# EAGLE design wifi_reprap2 (EAGLE 7.4.0)
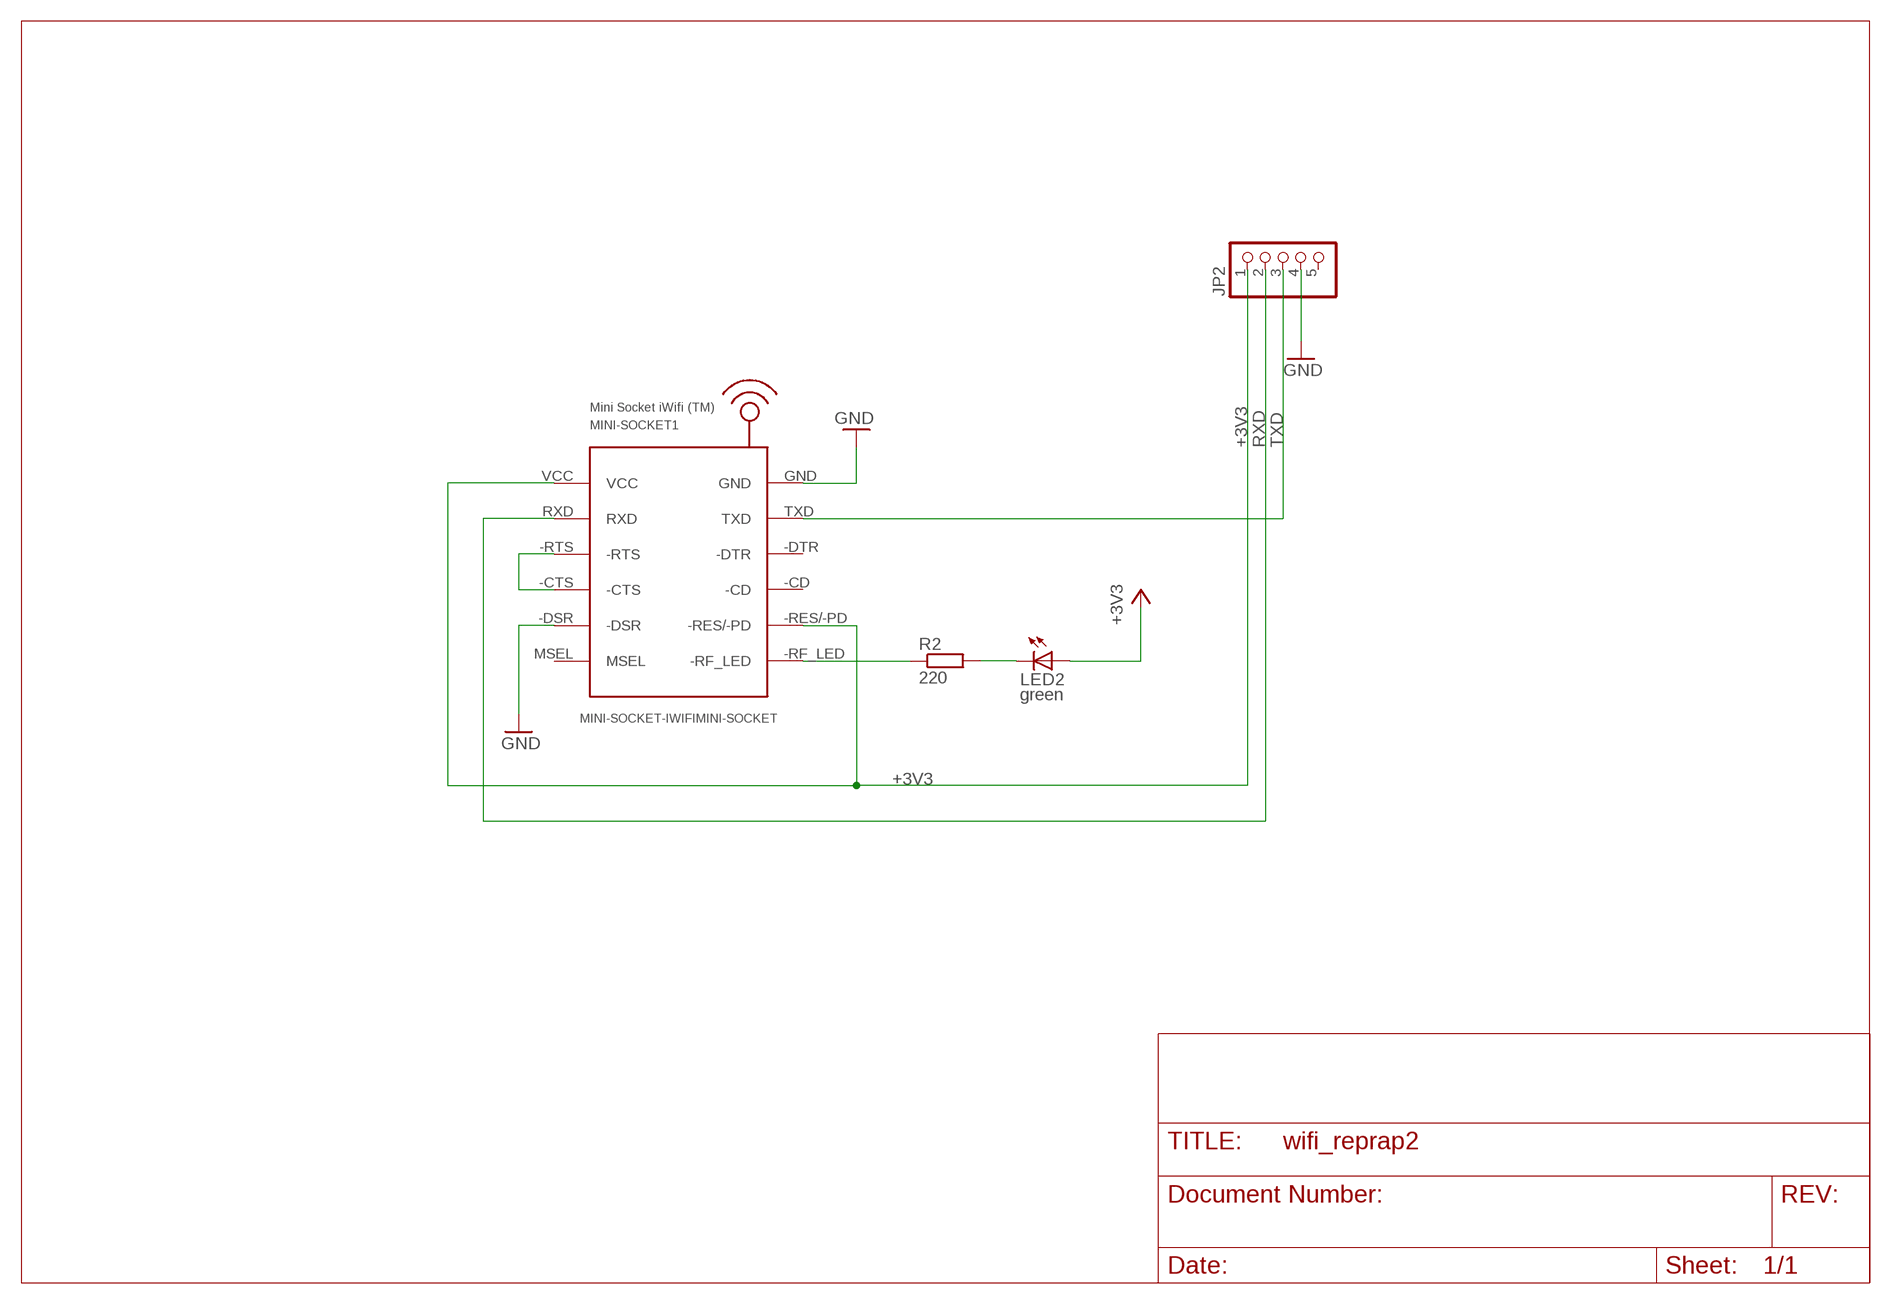
[diagram p0: schematic, sheet 1]

## Parts
JP2  PINHD-1X5  [1X05]
LED2  green  LED5MM  [LED5MM]
MINI-SOCKET1  MINI-SOCKET-IWIFIMINI-SOCKET  [MINI-SOCKET-IWIFI]
R2  220  R-EU_0207/10  [0207/10]

## Nets
+3V3: JP2.1 LED2.A MINI-SOCKET1.-RES/-PD MINI-SOCKET1.VCC
GND: JP2.4 MINI-SOCKET1.-DSR MINI-SOCKET1.GND
N$2: LED2.K(C) R2.2
N$5: MINI-SOCKET1.-RF_LED R2.1
N$6: MINI-SOCKET1.-CTS MINI-SOCKET1.-RTS
RXD: JP2.2 MINI-SOCKET1.RXD
TXD: JP2.3 MINI-SOCKET1.TXD
Unconnected: JP2.5 MINI-SOCKET1.-CD MINI-SOCKET1.-DTR MINI-SOCKET1.MSEL

## Library data of the parts
JP2 = pinhead:PINHD-1X5: PIN HEADER
LED2 = led:LED: LED OSRAM: - CHIPLED LG R971, LG N971, LY N971, LG Q971, LY Q971, LO R971, LY R971 LH N974, LH R974 LS Q976, LO Q976, LY Q976 LO Q996 - Hyper CHIPLED LW Q18S LB Q993, LB Q99A, LB R99A - SideLED LS A670, LO A670, LY A670, LG A670, LP A670 LB A673, LV A673, LT A673, LW A673 LH A674 LY A675 LS A676, LA A676, LO A676, LY A676, LW A676 LS A679, LY A679, LG A679 - Hyper Micro SIDELED® LS Y876, LA Y876, LO Y876, LY Y876 LT Y87S - SmartLED LW L88C, LW L88S LB L89C, LB L89S, LG L890 LS L89K, LO L89K, LY L89K LS L896, LA L896, LO L896, LY L896 - TOPLED LS T670, LO T670, LY T670, LG T670, LP T670 LSG T670, LSP T670, LSY T670, LOP T670, LYG T670 LG T671, LOG T671, LSG T671 LB T673, LV T673, LT T673, LW T673 LH T674 LS T676, LA T676, LO T676, LY T676, LB T676, LH T676, LSB T676, LW T676 LB T67C, LV T67C, LT T67C, LS T67K, LO T67K, LY T67K, LW E67C LS E67B, LA E67B, LO E67B, LY E67B, LB E67C, LV E67C, LT E67C LW T67C LS T679, LY T679, LG T679 LS T770, LO T770, LY T770, LG T770, LP T770 LB T773, LV T773, LT T773, LW T773 LH T774 LS E675, LA E675, LY E675, LS T675 LS T776, LA T776, LO T776, LY T776, LB T776 LHGB T686 LT T68C, LB T68C - Hyper Mini TOPLED® LB M676 - Mini TOPLED Santana® LG M470 LS M47K, LO M47K, LY M47K Source: http://www.osram.convergy.de LUXEON: - LUMILED® LXK2-PW12-R00, LXK2-PW12-S00, LXK2-PW14-U00, LXK2-PW14-V00 LXK2-PM12-R00, LXK2-PM12-S00, LXK2-PM14-U00 LXK2-PE12-Q00, LXK2-PE12-R00, LXK2-PE12-S00, LXK2-PE14-T00, LXK2-PE14-U00 LXK2-PB12-K00, LXK2-PB12-L00, LXK2-PB12-M00, LXK2-PB14-N00, LXK2-PB14-P00, LXK2-PB14-Q00 LXK2-PR12-L00, LXK2-PR12-M00, LXK2-PR14-Q00, LXK2-PR14-R00 LXK2-PD12-Q00, LXK2-PD12-R00, LXK2-PD12-S00 LXK2-PH12-R00, LXK2-PH12-S00 LXK2-PL12-P00, LXK2-PL12-Q00, LXK2-PL12-R00 Source: www.luxeon.com KINGBRIGHT: KA-3528ASYC Source: www.kingbright.com
MINI-SOCKET1 = ajgl:MINI-SOCKET-IWIFI
R2 = rcl:R-EU_: RESISTOR, European symbol

## Board
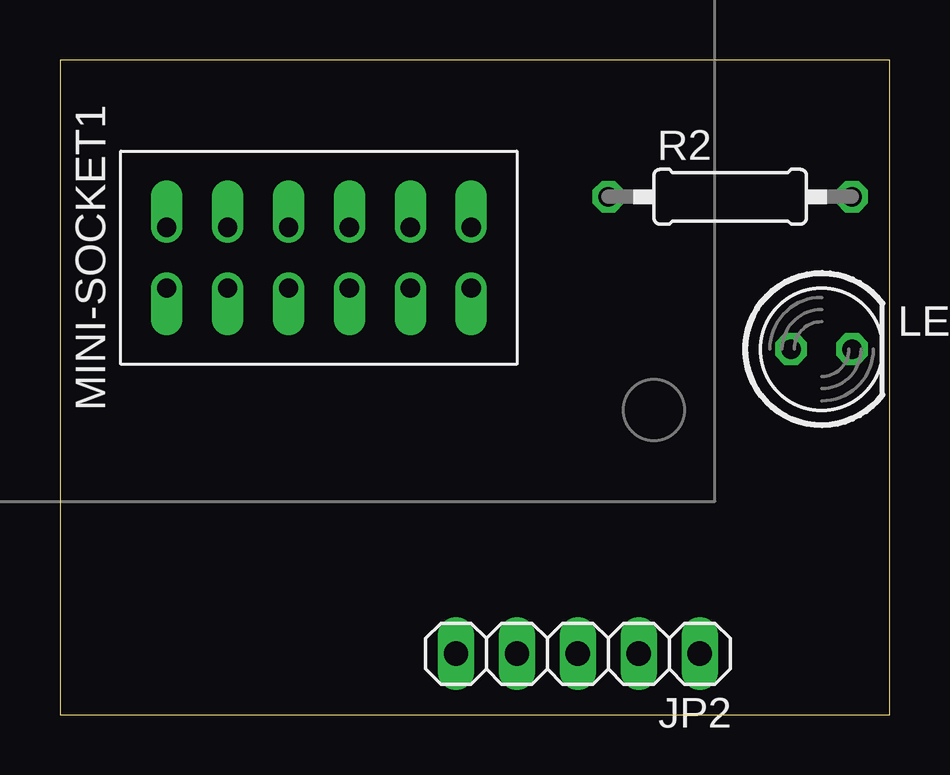
[diagram p1: board, top side]
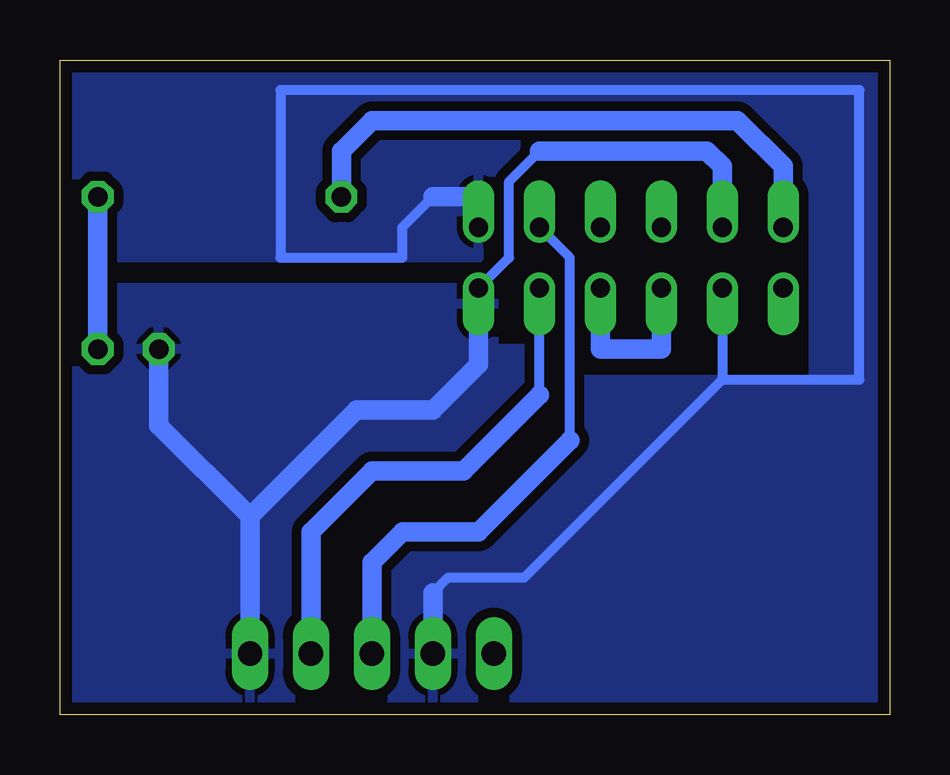
[diagram p2: board, bottom side, seen from below]

Size 34.59 x 27.3 mm. Coordinates in mm from the lower left corner, seen from the top.
Outline: 0,0 34.59,0 34.59,27.3 0,27.3 0,0
Copper layers (1*16): Top 0.035mm / dielectric 1.5mm / Bottom 0.035mm
Design rules "default *": minimum track width 10mil, minimum drill 24mil, track to track 0.4mm, track to pad 0.4mm, pad to pad 8mil, via to via 8mil, smd to smd 8mil, copper to edge 0.5mm, drill to drill 8mil, minimum pad ring 10mil, minimum via ring 8mil, stop-mask expansion 4mil, vias tented up to drill 0mil, thermal gap 10mil

### Footprints (pad centres in the part's own frame; a part is rotated, then mirrored left to right if it is on the bottom)
1X05 = drill 1.016 long: 1 -5.08,0; 2 -2.54,0; 3 0,0; 4 2.54,0; 5 5.08,0
LED5MM = drill 0.813 octagon: A -1.27,0; K 1.27,0
MINI-SOCKET-IWIFI = drill 0.8 offset: -CD 20.32,23.495; -CTS 22.86,23.495; -DSR 22.86,20.955; -DTR 20.32,26.035; -RES/-PD 20.32,20.955; -RF_LED 20.32,18.415; -RTS 22.86,26.035; GND 20.32,31.115; MSEL 22.86,18.415; RXD 22.86,28.575; TXD 20.32,28.575; VCC 22.86,31.115
0207/10 = drill 0.813 octagon: 1 -5.08,0; 2 5.08,0

### Placement (x,y rotation side)
JP2  21.59,2.54 180 top
LED2  31.75,15.24 0 top
MINI-SOCKET1  -13.97,40.64 270 top
R2  27.94,21.59 0 top

### Tracks (layer width: path | path; a pad name or v marks a point on that pad's centre or on a via)
+3V3
  Bottom 0.406: MINI-SOCKET1.VCC 15.87,19.05 15.87,22.23 14.6,23.5
  Bottom 0.813: JP2.1 26.67,8.26 | 26.67,8.26 22.23,12.7 19.05,12.7 17.14,14.61 MINI-SOCKET1.VCC | LED2.A 30.48,12.06 26.67,8.26 | 14.6,23.5 7.62,23.5 6.98,22.86 MINI-SOCKET1.-RES/-PD
  pour Bottom: 24.13,0 24.13,7.62 21.59,10.16 17.78,10.16 14.6,13.34 14.6,15.24 16.51,15.24 16.51,17.78 34.29,17.78 34.29,0
GND
  Bottom 0.406: 19.05,5.08 18.41,5.71 15.24,5.71 6.98,13.97 | MINI-SOCKET1.-DSR 6.98,13.97 | 6.98,13.97 1.27,13.97 1.27,26.04 25.4,26.04 25.4,19.05 20.32,19.05 20.32,20.32 19.05,21.59
  Bottom 0.813: JP2.4 19.05,5.08 | 19.05,21.59 17.14,21.59 MINI-SOCKET1.GND
  pour Bottom: 21.59,0 21.59,6.35 20.32,7.62 17.14,7.62 13.33,11.43 13.33,13.97 3.17,13.97 3.17,21.59 6.35,24.77 13.97,24.77 17.14,21.59 17.14,19.05 34.29,19.05 34.29,27.3 0,27.3 0,0
N$2
  Bottom 0.813: LED2.K R2.2
N$5
  Bottom 0.813: R2.1 22.86,23.5 21.59,24.77 6.35,24.77 4.44,22.86 MINI-SOCKET1.-RF_LED
N$6
  Bottom 0.813: MINI-SOCKET1.-CTS 9.53,15.24 12.06,15.24 MINI-SOCKET1.-RTS
RXD
  Bottom 0.406: 14.6,13.34 MINI-SOCKET1.RXD
  Bottom 0.813: JP2.2 24.13,7.62 21.59,10.16 17.78,10.16 14.6,13.34
TXD
  Bottom 0.406: 13.33,11.43 13.33,19.05 MINI-SOCKET1.TXD
  Bottom 0.813: JP2.3 21.59,6.35 20.32,7.62 17.14,7.62 13.33,11.43